# Altium schematic sheet motor_controllers_connection.SchDoc
size A3; SheetNumber: 2; SheetTotal: 5
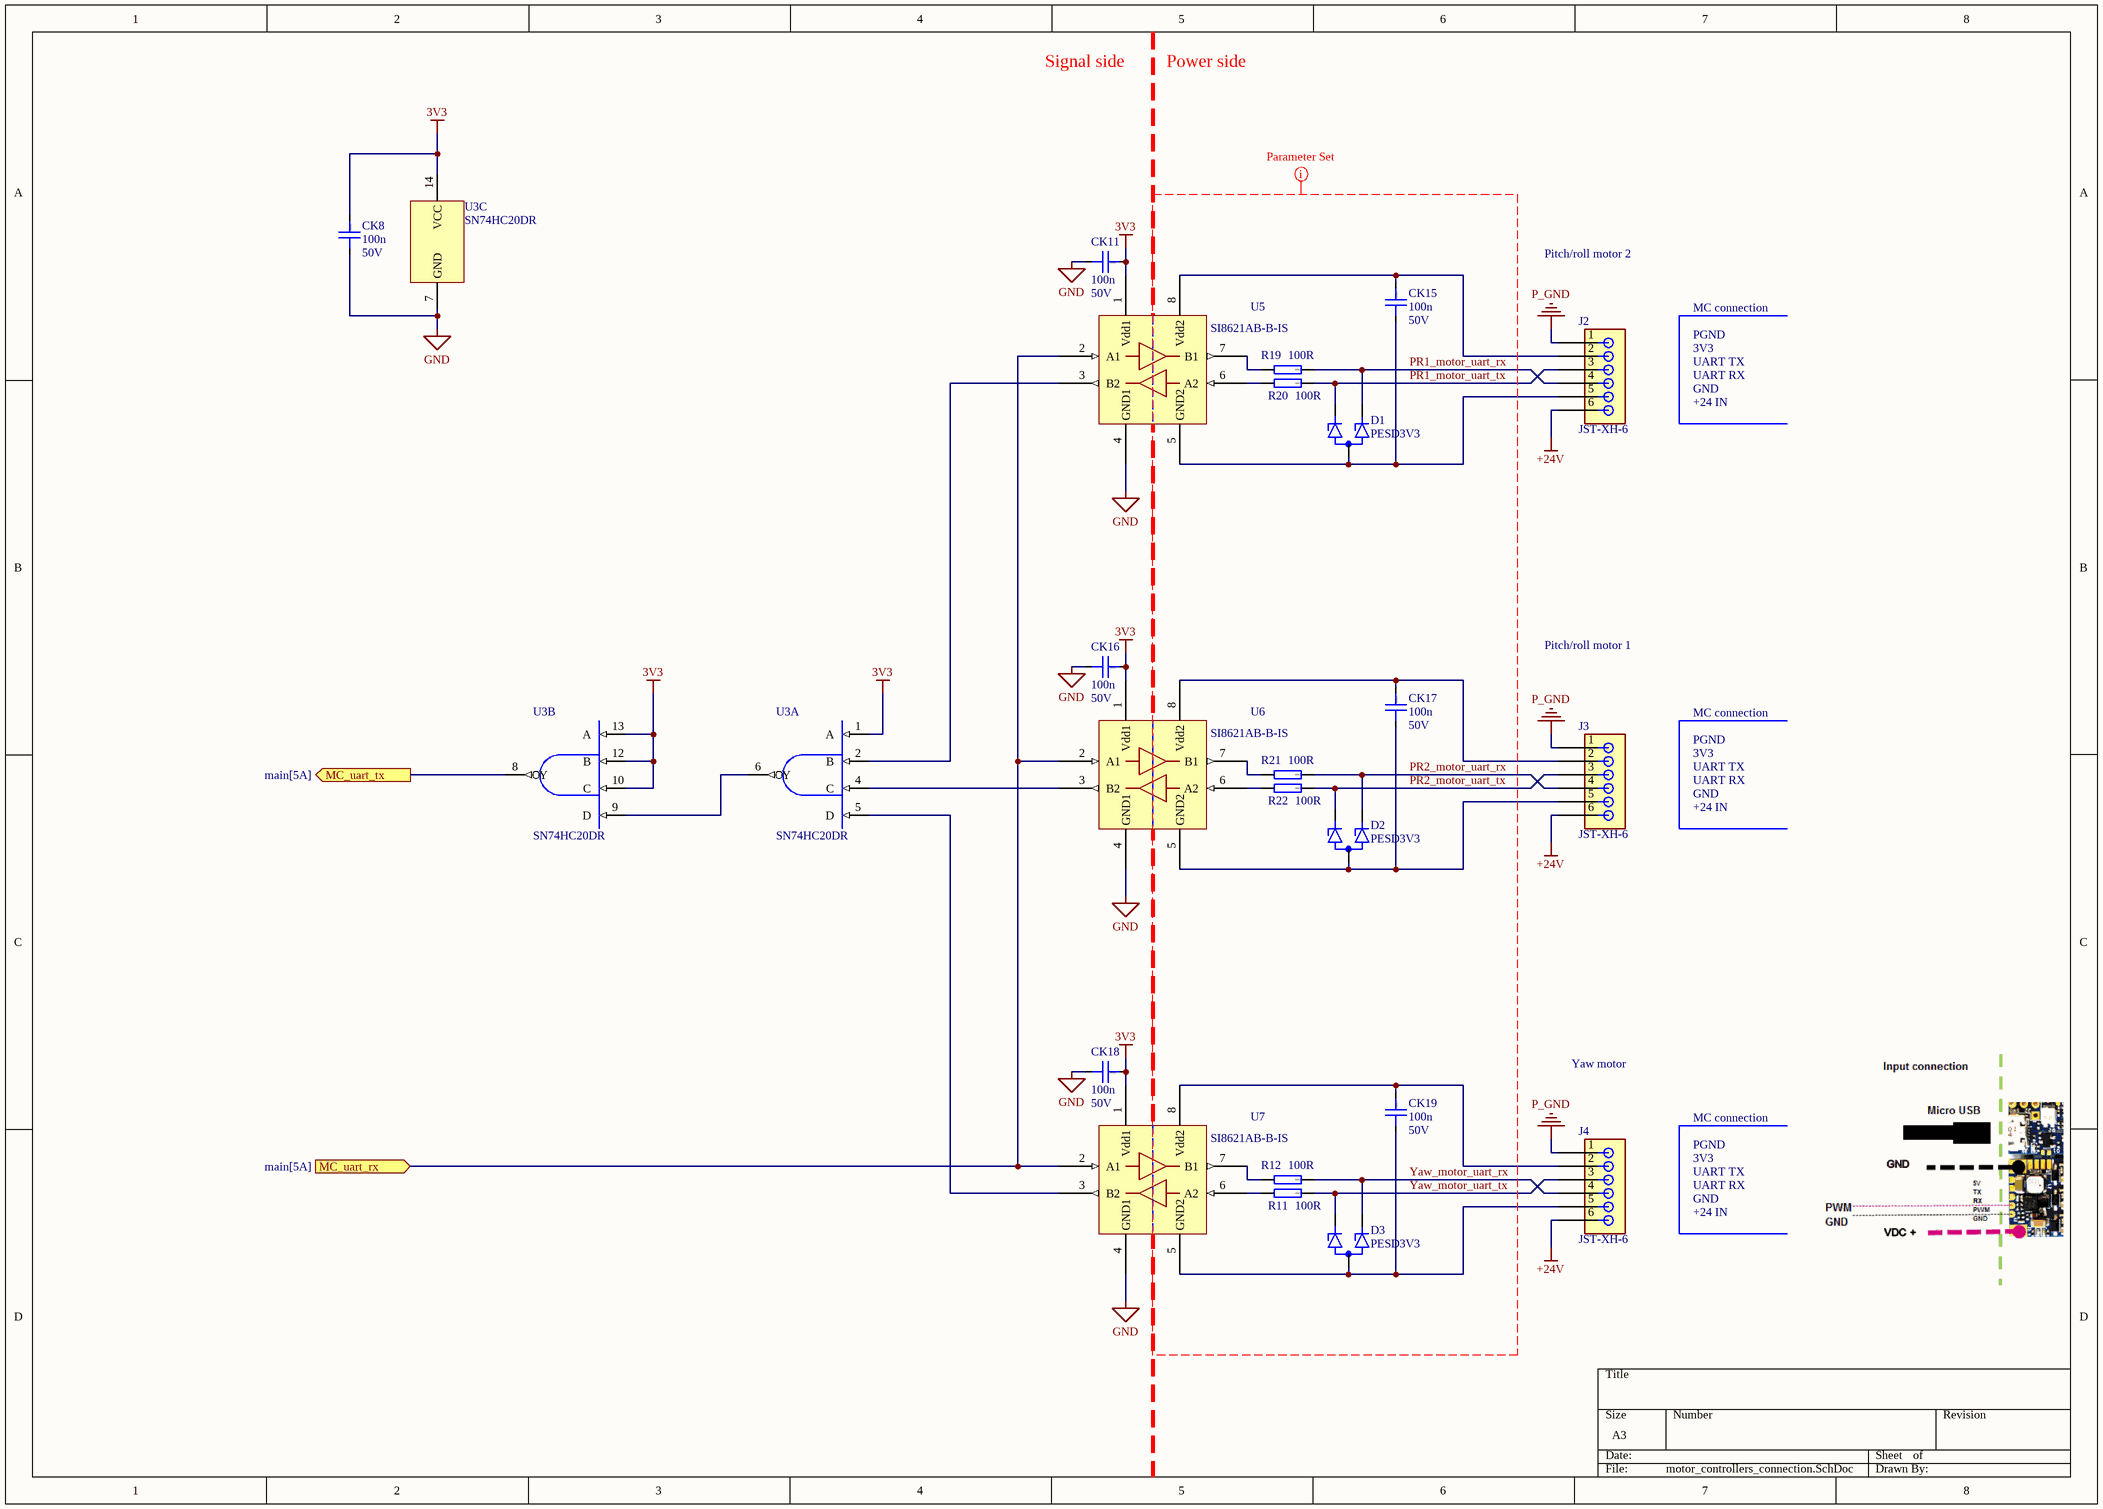
[diagram p0: motor_controllers_connection.SchDoc]

## Parts
CK8  100n  Voltage rating: 50V  [CAP0603]
CK11  100n  Voltage rating: 50V  [CAP0603]
CK15  100n  Voltage rating: 50V  [CAP0603]
CK16  100n  Voltage rating: 50V  [CAP0603]
CK17  100n  Voltage rating: 50V  [CAP0603]
CK18  100n  Voltage rating: 50V  [CAP0603]
CK19  100n  Voltage rating: 50V  [CAP0603]
D1  PESD3V3  [SOT95P230X110-3N(SOT23)]
D2  PESD3V3  [SOT95P230X110-3N(SOT23)]
D3  PESD3V3  [SOT95P230X110-3N(SOT23)]
J2  JST-XH-6  [JST-XH-6]
J3  JST-XH-6  [JST-XH-6]
J4  JST-XH-6  [JST-XH-6]
R11  100R  [RESC2012X06N(SMR0805)]
R12  100R  [RESC2012X06N(SMR0805)]
R19  100R  [RESC2012X06N(SMR0805)]
R20  100R  [RESC2012X06N(SMR0805)]
R21  100R  [RESC2012X06N(SMR0805)]
R22  100R  [RESC2012X06N(SMR0805)]
U3  SN74HC20DR  [SOIC14]  (parts A,B,C of 3)
U5  SI8621AB-B-IS  [SOIC8]
U6  SI8621AB-B-IS  [SOIC8]
U7  SI8621AB-B-IS  [SOIC8]

## Ports
MC_uart_rx (in, see main[5A]), MC_uart_tx (out, see main[5A])

## Nets
3V3: CK8.1 CK11.1 CK16.1 CK18.1 U3.1(A) U3.10(C) U3.12(B) U3.13(A) U3.14(VCC) U5.1(Vdd1) U6.1(Vdd1) U7.1(Vdd1)
+24V: J2.6 J3.6 J4.6
GND: CK8.2 CK11.2 CK16.2 CK18.2 U3.7(GND) U5.4(GND1) U6.4(GND1) U7.4(GND1)
P_GND: J2.1 J3.1 J4.1
MC_uart_rx: U5.2(A1) U6.2(A1) U7.2(A1) ; port MC_uart_rx
MC_uart_tx: U3.8(Y) ; port MC_uart_tx
PR1_motor_uart_rx: D1.1(K1) J2.4 R19.2
PR1_motor_uart_tx: D1.2(K2) J2.3 R20.2
PR2_motor_uart_rx: D2.1(K1) J3.4 R21.2
PR2_motor_uart_tx: D2.2(K2) J3.3 R22.2
Yaw_motor_uart_rx: D3.1(K1) J4.4 R12.2
Yaw_motor_uart_tx: D3.2(K2) J4.3 R11.2
NetCK15_1: CK15.1 J2.2 U5.8(Vdd2)
NetCK15_2: CK15.2 D1.3(A) J2.5 U5.5(GND2)
NetCK17_1: CK17.1 J3.2 U6.8(Vdd2)
NetCK17_2: CK17.2 D2.3(A) J3.5 U6.5(GND2)
NetCK19_1: CK19.1 J4.2 U7.8(Vdd2)
NetCK19_2: CK19.2 D3.3(A) J4.5 U7.5(GND2)
NetR11_1: R11.1 U7.6(A2)
NetR12_1: R12.1 U7.7(B1)
NetR19_1: R19.1 U5.7(B1)
NetR20_1: R20.1 U5.6(A2)
NetR21_1: R21.1 U6.7(B1)
NetR22_1: R22.1 U6.6(A2)
NetU3_2: U3.2(B) U5.3(B2)
NetU3_4: U3.4(C) U6.3(B2)
NetU3_5: U3.5(D) U7.3(B2)
NetU3_6: U3.6(Y) U3.9(D)

## Layout directives
net class MC_isol: PR1_motor_uart_rx, PR1_motor_uart_tx, PR2_motor_uart_rx, PR2_motor_uart_tx, Yaw_motor_uart_rx, Yaw_motor_uart_tx

## Notes on the sheet
- Signal side
- Power side
- Pitch/roll motor 2
- MC connection
- PGND
- 3V3
- UART RX
- UART TX
- GND
- +24 IN
- Pitch/roll motor 1
- Yaw motor
- (in symbol Cap 100n 0603) 0603

## Library data of the parts
CK8 CK11 CK15-CK19 = Cap 100n 0603: 50V 100nF X7R ±10% 0603 Multilayer Ceramic Capacitors MLCC - SMD/SMT ROHS; Basic: Yes; Value: 100n; JLCPCB Part: C14663
D1-D3 = PESD3V3S2UT,215: 18A 20V 5.2V Unidirectional 3.3V SOT-23 ESD and Surge Protection (TVS/ESD) ROHS; Basic: No; JLCPCB Part: C84276; TME Part: PESD3V3S2UT.215
J2-J4 = JST-HX-6: 1x6P 6P XH Tin 6 -25℃~+85℃ 3A 1 2.5mm Brass Bend insert Push-Pull,P=2.5mm Wire To Board Connector ROHS; S6B-XH-A(LF)(SN); Basic: No; JLCPCB Part: C157919; TME Part: S6B-XH-A
R11 R12 R19-R22 = Res 100R 0805: 125mW Thick Film Resistors 150V ±100ppm/℃ ±1% 100Ω 0805 Chip Resistor - Surface Mount ROHS; Tolerance & Rating: 1%/0.1W; Basic: Yes; Value: 100R; Package: 0805; Author: JP/27.03.2014; SMD: 1; ComponentLink3Description: rezistor čip; ComponentLink3URL: heliosgreen://v1/hegMT/5-MT/Classes(343)/Folders/OpenForm?RecordNumbers=[381513]; JLCPCB Part: C17408
U3 = SN74HC20DR: 2V~6V 2uA 2 19ns@6V,50pF NAND Gates SOIC-14 Logic Gates ROHS; Basic: No; JLCPCB Part: C2867684; TME Part: SN74HC20DR
U5-U7 = SI8621AB-B-IS: SOIC-8 Digital Isolators ROHS; Basic: No; JLCPCB Part: C430265; TME Part: SI8621AB-B-IS